# Altium schematic sheet Snippet of USB.SchDoc
size A3
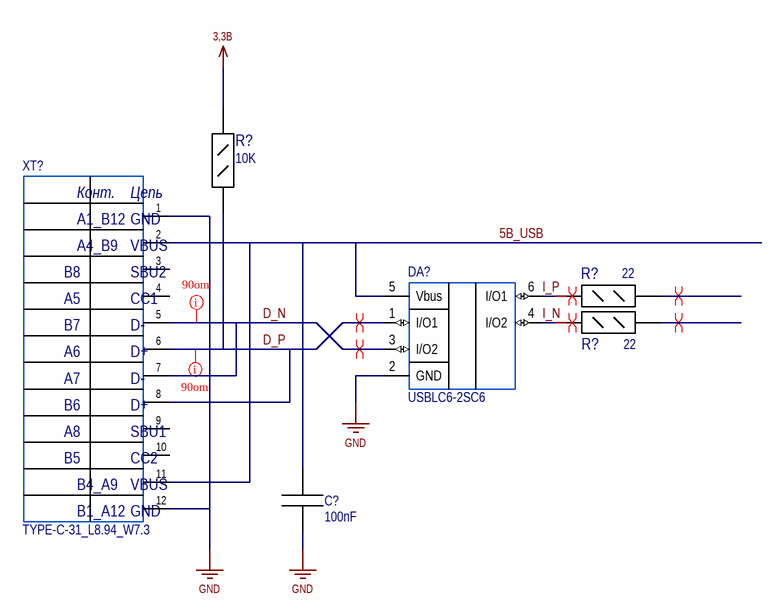
[diagram p0: Snippet of USB.SchDoc]

## Parts
(Parts that share a designator on the sheet are numbered #1, #2 ... from top to bottom, then left to right.)
C?  100nF  [CAP-0603]
DA?  USBLC6-2SC6  [SOT-23-6]
R?#1  10K
R?#2  22  [RES-0603]
R?#3  22  [RES-0603]
XT?  TYPE-C-31_L8.94_W7.3  [USB TYPE C 24 - 1]

## Nets
3,3В: R?#1.2
GND: C?.1 DA?.2(GND) XT?.1 XT?.12
5В_USB: C?.2 DA?.5(Vbus) XT?.2 XT?.11
D_N: DA?.3(I/O2) XT?.5 XT?.7
D_P: DA?.1(I/O1) R?#1.1 XT?.6 XT?.8
I_N: DA?.4(I/O2) R?#3.1
I_P: DA?.6(I/O1) R?#2.1

Not connected (* = marked no-connect by the designer): R?#2 2; R?#3 2; XT? 3 4 9 10

## Layout directives
differential pair: D_N, D_P, I_N, I_P, NetR?#2_2, NetR?#3_2
mark named 90om: D_N, D_P

## Notes on the sheet
- (in symbol USB Type C_12pin) Конт.; Цепь; A1_B12; GND; A4_B9; VBUS; B8; SBU2; A5; CC1; B7; D-; A6; D+; A7; B6; A8; SBU1; B5; CC2; B4_A9; B1_A12

## Library data of the parts
C? = Конденсатор постоянной емкости: Capacitor; Part: CC0402KRX7R6BB104; Value: 100nF; Alternative part: *; ComponentLink1Description: Link; ComponentLink1URL: https://www.electronshik.ru/item/YAG/CC0402KRX7R6BB104; ComponentLink2Description: Altenative link; ComponentLink2URL: *
DA? = USBLC6-2SC6: Part: C2827654; Value: USBLC6-2SC6; Alternative part: USBLC6-2SC6; ComponentLink1Description: Link; ComponentLink1URL: *
R?#1 = Резистор постоянный 0,125Вт: Part: *; Alternative part: *; Value: 10K; ComponentLink1Description: Link; ComponentLink1URL: *; ComponentLink2Description: Alternative link; ComponentLink2URL: *
R?#2 R?#3 = Резистор постоянный 0,125Вт: Part: RC0603FR-0722RL; Alternative part: *; Value: 22; ComponentLink1Description: Link; ComponentLink1URL: https://www.electronshik.ru/item/YAG/RC0603FR-0722RL; ComponentLink2Description: Alternative link
XT? = USB Type C_12pin: Part: C165948; Value: TYPE-C-31_L8.94_W7.3; Alternative part: *; ComponentLink1Description: Link; ComponentLink1URL: https://www.elitan.ru/price/item28438547